# Altium schematic sheet FIT_FPGA_B_D_F.SchDoc
size A3; SheetNumber: 18; SheetTotal: 29
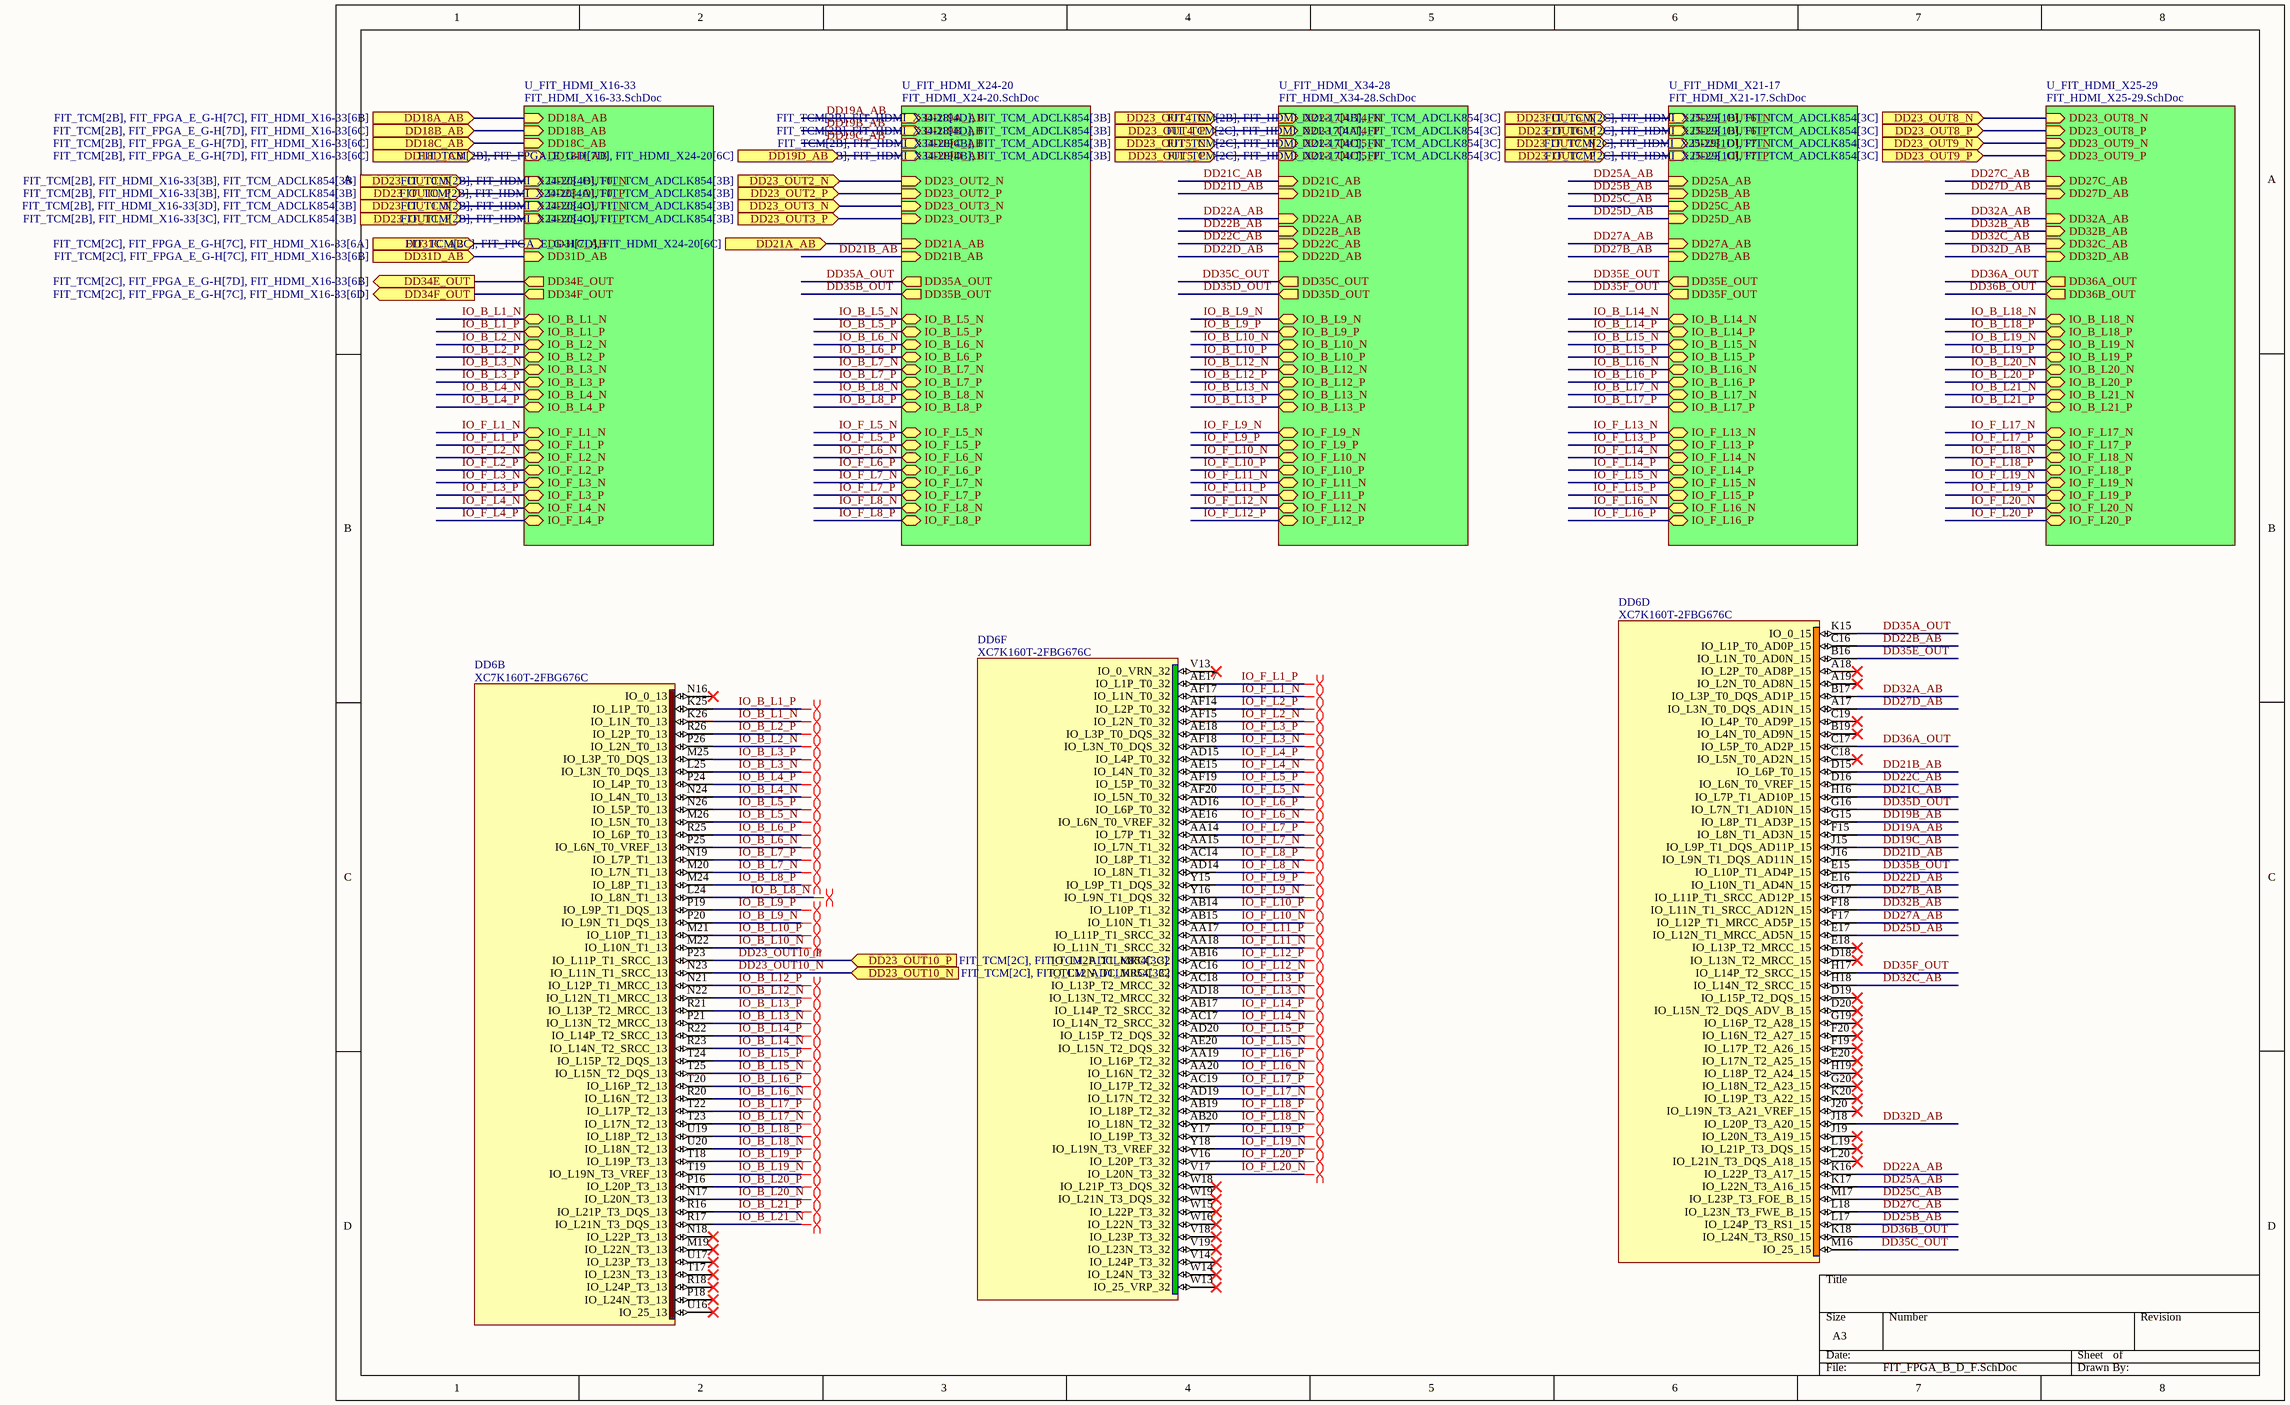
[diagram p0: FIT_FPGA_B_D_F.SchDoc]

## Parts
DD6  XC7K160T-2FBG676C  [BGA676C100P26X26_2700X2700X254]  (parts B,D,F of 15)

## Sub-sheets
U_FIT_HDMI_X16-33 = FIT_HDMI_X16-33.SchDoc: IO_F_L1_P (bidir), IO_F_L1_N (bidir), IO_F_L2_P (bidir), IO_F_L2_N (bidir), IO_B_L1_P (bidir), IO_B_L1_N (bidir), IO_B_L2_P (bidir), IO_B_L2_N (bidir), DD23_OUT0_P (in), DD23_OUT0_N (in), IO_F_L3_P (bidir), IO_F_L3_N (bidir), IO_F_L4_P (bidir), IO_F_L4_N (bidir), IO_B_L3_P (bidir), IO_B_L3_N (bidir), IO_B_L4_P (bidir), IO_B_L4_N (bidir), DD23_OUT1_P (in), DD23_OUT1_N (in), DD31C_AB (in), DD31D_AB (in), DD18A_AB (in), DD34E_OUT (out), DD18B_AB (in), DD18C_AB (in), DD18D_AB (in), DD34F_OUT (out)
U_FIT_HDMI_X21-17 = FIT_HDMI_X21-17.SchDoc: IO_F_L13_P (bidir), IO_F_L13_N (bidir), IO_F_L14_P (bidir), IO_F_L14_N (bidir), IO_B_L14_P (bidir), IO_B_L14_N (bidir), IO_B_L15_P (bidir), IO_B_L15_N (bidir), DD23_OUT6_P (in), DD23_OUT6_N (in), IO_F_L15_P (bidir), IO_F_L15_N (bidir), IO_F_L16_P (bidir), IO_F_L16_N (bidir), IO_B_L16_P (bidir), IO_B_L16_N (bidir), IO_B_L17_P (bidir), IO_B_L17_N (bidir), DD23_OUT7_P (in), DD23_OUT7_N (in), DD25A_AB (in), DD25B_AB (in), DD25C_AB (in), DD35E_OUT (out), DD25D_AB (in), DD27A_AB (in), DD27B_AB (in), DD35F_OUT (out)
U_FIT_HDMI_X24-20 = FIT_HDMI_X24-20.SchDoc: IO_F_L5_P (bidir), IO_F_L5_N (bidir), IO_F_L6_P (bidir), IO_F_L6_N (bidir), IO_B_L5_P (bidir), IO_B_L5_N (bidir), IO_B_L6_P (bidir), IO_B_L6_N (bidir), DD23_OUT2_P (in), DD23_OUT2_N (in), IO_F_L7_P (bidir), IO_F_L7_N (bidir), IO_F_L8_P (bidir), IO_F_L8_N (bidir), IO_B_L7_P (bidir), IO_B_L7_N (bidir), IO_B_L8_P (bidir), IO_B_L8_N (bidir), DD23_OUT3_P (in), DD23_OUT3_N (in), DD19A_AB (in), DD19B_AB (in), DD19C_AB (in), DD35A_OUT (out), DD19D_AB (in), DD21A_AB (in), DD21B_AB (in), DD35B_OUT (out)
U_FIT_HDMI_X25-29 = FIT_HDMI_X25-29.SchDoc: IO_B_L19_N (bidir), DD23_OUT8_P (in), DD23_OUT8_N (in), IO_B_L19_P (bidir), IO_B_L18_N (bidir), IO_B_L18_P (bidir), IO_F_L18_N (bidir), IO_F_L18_P (bidir), IO_F_L17_N (bidir), IO_F_L17_P (bidir), DD27C_AB (in), DD27D_AB (in), DD32A_AB (in), DD36A_OUT (out), IO_F_L19_P (bidir), IO_F_L19_N (bidir), IO_F_L20_P (bidir), IO_F_L20_N (bidir), IO_B_L20_P (bidir), IO_B_L20_N (bidir), IO_B_L21_P (bidir), IO_B_L21_N (bidir), DD23_OUT9_P (in), DD23_OUT9_N (in), DD32B_AB (in), DD32C_AB (in), DD32D_AB (in), DD36B_OUT (out)
U_FIT_HDMI_X34-28 = FIT_HDMI_X34-28.SchDoc: IO_F_L11_P (bidir), IO_F_L11_N (bidir), IO_F_L12_P (bidir), IO_F_L12_N (bidir), IO_B_L12_P (bidir), IO_B_L12_N (bidir), IO_B_L13_P (bidir), IO_B_L13_N (bidir), DD23_OUT5_P (in), DD23_OUT5_N (in), IO_F_L9_P (bidir), IO_F_L9_N (bidir), IO_F_L10_P (bidir), IO_F_L10_N (bidir), IO_B_L9_P (bidir), IO_B_L9_N (bidir), IO_B_L10_P (bidir), IO_B_L10_N (bidir), DD23_OUT4_P (in), DD23_OUT4_N (in), DD22B_AB (in), DD22C_AB (in), DD22D_AB (in), DD35D_OUT (out), DD21C_AB (in), DD21D_AB (in), DD22A_AB (in), DD35C_OUT (out)

## Ports
DD18A_AB (in, see FIT_TCM[2B], FIT_FPGA_E_G-H[7C], FIT_HDMI_X16-33[6B]), DD18B_AB (in, see FIT_TCM[2B], FIT_FPGA_E_G-H[7D], FIT_HDMI_X16-33[6C]), DD18C_AB (in, see FIT_TCM[2B], FIT_FPGA_E_G-H[7D], FIT_HDMI_X16-33[6C]), DD18D_AB (in, see FIT_TCM[2B], FIT_FPGA_E_G-H[7D], FIT_HDMI_X16-33[6C]), DD19D_AB (in, see FIT_TCM[2B], FIT_FPGA_E_G-H[7D], FIT_HDMI_X24-20[6C]), DD21A_AB (in, see FIT_TCM[2C], FIT_FPGA_E_G-H[7D], FIT_HDMI_X24-20[6C]), DD23_OUT0_N (in, see FIT_TCM[2B], FIT_HDMI_X16-33[3B], FIT_TCM_ADCLK854[3B]), DD23_OUT0_P (in, see FIT_TCM[2B], FIT_HDMI_X16-33[3B], FIT_TCM_ADCLK854[3B]), DD23_OUT1_N (in, see FIT_TCM[2B], FIT_HDMI_X16-33[3D], FIT_TCM_ADCLK854[3B]), DD23_OUT1_P (in, see FIT_TCM[2B], FIT_HDMI_X16-33[3C], FIT_TCM_ADCLK854[3B]), DD23_OUT2_N (in, see FIT_TCM[2B], FIT_HDMI_X24-20[4B], FIT_TCM_ADCLK854[3B]), DD23_OUT2_P (in, see FIT_TCM[2B], FIT_HDMI_X24-20[4A], FIT_TCM_ADCLK854[3B]), DD23_OUT3_N (in, see FIT_TCM[2B], FIT_HDMI_X24-20[4C], FIT_TCM_ADCLK854[3B]), DD23_OUT3_P (in, see FIT_TCM[2B], FIT_HDMI_X24-20[4C], FIT_TCM_ADCLK854[3B]), DD23_OUT4_N (in, see FIT_TCM[2B], FIT_HDMI_X34-28[4D], FIT_TCM_ADCLK854[3B]), DD23_OUT4_P (in, see FIT_TCM[2B], FIT_HDMI_X34-28[4D], FIT_TCM_ADCLK854[3B]), DD23_OUT5_N (in, see FIT_TCM[2B], FIT_HDMI_X34-28[4B], FIT_TCM_ADCLK854[3B]), DD23_OUT5_P (in, see FIT_TCM[2B], FIT_HDMI_X34-28[4B], FIT_TCM_ADCLK854[3B]), DD23_OUT6_N (in, see FIT_TCM[2B], FIT_HDMI_X21-17[4B], FIT_TCM_ADCLK854[3C]), DD23_OUT6_P (in, see FIT_TCM[2C], FIT_HDMI_X21-17[4A], FIT_TCM_ADCLK854[3C]), DD23_OUT7_N (in, see FIT_TCM[2C], FIT_HDMI_X21-17[4C], FIT_TCM_ADCLK854[3C]), DD23_OUT7_P (in, see FIT_TCM[2C], FIT_HDMI_X21-17[4C], FIT_TCM_ADCLK854[3C]), DD23_OUT8_N (in, see FIT_TCM[2C], FIT_HDMI_X25-29[1B], FIT_TCM_ADCLK854[3C]), DD23_OUT8_P (in, see FIT_TCM[2C], FIT_HDMI_X25-29[1B], FIT_TCM_ADCLK854[3C]), DD23_OUT9_N (in, see FIT_TCM[2C], FIT_HDMI_X25-29[1D], FIT_TCM_ADCLK854[3C]), DD23_OUT9_P (in, see FIT_TCM[2C], FIT_HDMI_X25-29[1C], FIT_TCM_ADCLK854[3C]), DD23_OUT10_N (in, see FIT_TCM[2C], FIT_TCM_ADCLK854[3C]), DD23_OUT10_P (in, see FIT_TCM[2C], FIT_TCM_ADCLK854[3C]), DD31C_AB (in, see FIT_TCM[2C], FIT_FPGA_E_G-H[7C], FIT_HDMI_X16-33[6A]), DD31D_AB (in, see FIT_TCM[2C], FIT_FPGA_E_G-H[7C], FIT_HDMI_X16-33[6B]), DD34E_OUT (out, see FIT_TCM[2C], FIT_FPGA_E_G-H[7D], FIT_HDMI_X16-33[6B]), DD34F_OUT (out, see FIT_TCM[2C], FIT_FPGA_E_G-H[7C], FIT_HDMI_X16-33[6D])

## Nets
DD18A_AB: port DD18A_AB, sheet U_FIT_HDMI_X16-33/DD18A_AB
DD18B_AB: port DD18B_AB, sheet U_FIT_HDMI_X16-33/DD18B_AB
DD18C_AB: port DD18C_AB, sheet U_FIT_HDMI_X16-33/DD18C_AB
DD18D_AB: port DD18D_AB, sheet U_FIT_HDMI_X16-33/DD18D_AB
DD19A_AB: DD6.F15(IO_L8N_T1_AD3N_15) ; sheet U_FIT_HDMI_X24-20/DD19A_AB
DD19B_AB: DD6.G15(IO_L8P_T1_AD3P_15) ; sheet U_FIT_HDMI_X24-20/DD19B_AB
DD19C_AB: DD6.J15(IO_L9P_T1_DQS_AD11P_15) ; sheet U_FIT_HDMI_X24-20/DD19C_AB
DD19D_AB: port DD19D_AB, sheet U_FIT_HDMI_X24-20/DD19D_AB
DD21A_AB: port DD21A_AB, sheet U_FIT_HDMI_X24-20/DD21A_AB
DD21B_AB: DD6.D15(IO_L6P_T0_15) ; sheet U_FIT_HDMI_X24-20/DD21B_AB
DD21C_AB: DD6.H16(IO_L7P_T1_AD10P_15) ; sheet U_FIT_HDMI_X34-28/DD21C_AB
DD21D_AB: DD6.J16(IO_L9N_T1_DQS_AD11N_15) ; sheet U_FIT_HDMI_X34-28/DD21D_AB
DD22A_AB: DD6.K16(IO_L22P_T3_A17_15) ; sheet U_FIT_HDMI_X34-28/DD22A_AB
DD22B_AB: DD6.C16(IO_L1P_T0_AD0P_15) ; sheet U_FIT_HDMI_X34-28/DD22B_AB
DD22C_AB: DD6.D16(IO_L6N_T0_VREF_15) ; sheet U_FIT_HDMI_X34-28/DD22C_AB
DD22D_AB: DD6.E16(IO_L10N_T1_AD4N_15) ; sheet U_FIT_HDMI_X34-28/DD22D_AB
DD23_OUT0_N: port DD23_OUT0_N, sheet U_FIT_HDMI_X16-33/DD23_OUT0_N
DD23_OUT0_P: port DD23_OUT0_P, sheet U_FIT_HDMI_X16-33/DD23_OUT0_P
DD23_OUT1_N: port DD23_OUT1_N, sheet U_FIT_HDMI_X16-33/DD23_OUT1_N
DD23_OUT1_P: port DD23_OUT1_P, sheet U_FIT_HDMI_X16-33/DD23_OUT1_P
DD23_OUT2_N: port DD23_OUT2_N, sheet U_FIT_HDMI_X24-20/DD23_OUT2_N
DD23_OUT2_P: port DD23_OUT2_P, sheet U_FIT_HDMI_X24-20/DD23_OUT2_P
DD23_OUT3_N: port DD23_OUT3_N, sheet U_FIT_HDMI_X24-20/DD23_OUT3_N
DD23_OUT3_P: port DD23_OUT3_P, sheet U_FIT_HDMI_X24-20/DD23_OUT3_P
DD23_OUT4_N: port DD23_OUT4_N, sheet U_FIT_HDMI_X34-28/DD23_OUT4_N
DD23_OUT4_P: port DD23_OUT4_P, sheet U_FIT_HDMI_X34-28/DD23_OUT4_P
DD23_OUT5_N: port DD23_OUT5_N, sheet U_FIT_HDMI_X34-28/DD23_OUT5_N
DD23_OUT5_P: port DD23_OUT5_P, sheet U_FIT_HDMI_X34-28/DD23_OUT5_P
DD23_OUT6_N: port DD23_OUT6_N, sheet U_FIT_HDMI_X21-17/DD23_OUT6_N
DD23_OUT6_P: port DD23_OUT6_P, sheet U_FIT_HDMI_X21-17/DD23_OUT6_P
DD23_OUT7_N: port DD23_OUT7_N, sheet U_FIT_HDMI_X21-17/DD23_OUT7_N
DD23_OUT7_P: port DD23_OUT7_P, sheet U_FIT_HDMI_X21-17/DD23_OUT7_P
DD23_OUT8_N: port DD23_OUT8_N, sheet U_FIT_HDMI_X25-29/DD23_OUT8_N
DD23_OUT8_P: port DD23_OUT8_P, sheet U_FIT_HDMI_X25-29/DD23_OUT8_P
DD23_OUT9_N: port DD23_OUT9_N, sheet U_FIT_HDMI_X25-29/DD23_OUT9_N
DD23_OUT9_P: port DD23_OUT9_P, sheet U_FIT_HDMI_X25-29/DD23_OUT9_P
DD23_OUT10_N: DD6.N23(IO_L11N_T1_SRCC_13) ; port DD23_OUT10_N
DD23_OUT10_P: DD6.P23(IO_L11P_T1_SRCC_13) ; port DD23_OUT10_P
DD25A_AB: DD6.K17(IO_L22N_T3_A16_15) ; sheet U_FIT_HDMI_X21-17/DD25A_AB
DD25B_AB: DD6.L17(IO_L24P_T3_RS1_15) ; sheet U_FIT_HDMI_X21-17/DD25B_AB
DD25C_AB: DD6.M17(IO_L23P_T3_FOE_B_15) ; sheet U_FIT_HDMI_X21-17/DD25C_AB
DD25D_AB: DD6.E17(IO_L12N_T1_MRCC_AD5N_15) ; sheet U_FIT_HDMI_X21-17/DD25D_AB
DD27A_AB: DD6.F17(IO_L12P_T1_MRCC_AD5P_15) ; sheet U_FIT_HDMI_X21-17/DD27A_AB
DD27B_AB: DD6.G17(IO_L11P_T1_SRCC_AD12P_15) ; sheet U_FIT_HDMI_X21-17/DD27B_AB
DD27C_AB: DD6.L18(IO_L23N_T3_FWE_B_15) ; sheet U_FIT_HDMI_X25-29/DD27C_AB
DD27D_AB: DD6.A17(IO_L3N_T0_DQS_AD1N_15) ; sheet U_FIT_HDMI_X25-29/DD27D_AB
DD31C_AB: port DD31C_AB, sheet U_FIT_HDMI_X16-33/DD31C_AB
DD31D_AB: port DD31D_AB, sheet U_FIT_HDMI_X16-33/DD31D_AB
DD32A_AB: DD6.B17(IO_L3P_T0_DQS_AD1P_15) ; sheet U_FIT_HDMI_X25-29/DD32A_AB
DD32B_AB: DD6.F18(IO_L11N_T1_SRCC_AD12N_15) ; sheet U_FIT_HDMI_X25-29/DD32B_AB
DD32C_AB: DD6.H18(IO_L14N_T2_SRCC_15) ; sheet U_FIT_HDMI_X25-29/DD32C_AB
DD32D_AB: DD6.J18(IO_L20P_T3_A20_15) ; sheet U_FIT_HDMI_X25-29/DD32D_AB
DD34E_OUT: port DD34E_OUT, sheet U_FIT_HDMI_X16-33/DD34E_OUT
DD34F_OUT: port DD34F_OUT, sheet U_FIT_HDMI_X16-33/DD34F_OUT
DD35A_OUT: DD6.K15(IO_0_15) ; sheet U_FIT_HDMI_X24-20/DD35A_OUT
DD35B_OUT: DD6.E15(IO_L10P_T1_AD4P_15) ; sheet U_FIT_HDMI_X24-20/DD35B_OUT
DD35C_OUT: DD6.M16(IO_25_15) ; sheet U_FIT_HDMI_X34-28/DD35C_OUT
DD35D_OUT: DD6.G16(IO_L7N_T1_AD10N_15) ; sheet U_FIT_HDMI_X34-28/DD35D_OUT
DD35E_OUT: DD6.B16(IO_L1N_T0_AD0N_15) ; sheet U_FIT_HDMI_X21-17/DD35E_OUT
DD35F_OUT: DD6.H17(IO_L14P_T2_SRCC_15) ; sheet U_FIT_HDMI_X21-17/DD35F_OUT
DD36A_OUT: DD6.C17(IO_L5P_T0_AD2P_15) ; sheet U_FIT_HDMI_X25-29/DD36A_OUT
DD36B_OUT: DD6.K18(IO_L24N_T3_RS0_15) ; sheet U_FIT_HDMI_X25-29/DD36B_OUT
IO_B_L1_N: DD6.K26(IO_L1N_T0_13) ; sheet U_FIT_HDMI_X16-33/IO_B_L1_N
IO_B_L1_P: DD6.K25(IO_L1P_T0_13) ; sheet U_FIT_HDMI_X16-33/IO_B_L1_P
IO_B_L2_N: DD6.P26(IO_L2N_T0_13) ; sheet U_FIT_HDMI_X16-33/IO_B_L2_N
IO_B_L2_P: DD6.R26(IO_L2P_T0_13) ; sheet U_FIT_HDMI_X16-33/IO_B_L2_P
IO_B_L3_N: DD6.L25(IO_L3N_T0_DQS_13) ; sheet U_FIT_HDMI_X16-33/IO_B_L3_N
IO_B_L3_P: DD6.M25(IO_L3P_T0_DQS_13) ; sheet U_FIT_HDMI_X16-33/IO_B_L3_P
IO_B_L4_N: DD6.N24(IO_L4N_T0_13) ; sheet U_FIT_HDMI_X16-33/IO_B_L4_N
IO_B_L4_P: DD6.P24(IO_L4P_T0_13) ; sheet U_FIT_HDMI_X16-33/IO_B_L4_P
IO_B_L5_N: DD6.M26(IO_L5N_T0_13) ; sheet U_FIT_HDMI_X24-20/IO_B_L5_N
IO_B_L5_P: DD6.N26(IO_L5P_T0_13) ; sheet U_FIT_HDMI_X24-20/IO_B_L5_P
IO_B_L6_N: DD6.P25(IO_L6N_T0_VREF_13) ; sheet U_FIT_HDMI_X24-20/IO_B_L6_N
IO_B_L6_P: DD6.R25(IO_L6P_T0_13) ; sheet U_FIT_HDMI_X24-20/IO_B_L6_P
IO_B_L7_N: DD6.M20(IO_L7N_T1_13) ; sheet U_FIT_HDMI_X24-20/IO_B_L7_N
IO_B_L7_P: DD6.N19(IO_L7P_T1_13) ; sheet U_FIT_HDMI_X24-20/IO_B_L7_P
IO_B_L8_N: DD6.L24(IO_L8N_T1_13) ; sheet U_FIT_HDMI_X24-20/IO_B_L8_N
IO_B_L8_P: DD6.M24(IO_L8P_T1_13) ; sheet U_FIT_HDMI_X24-20/IO_B_L8_P
IO_B_L9_N: DD6.P20(IO_L9N_T1_DQS_13) ; sheet U_FIT_HDMI_X34-28/IO_B_L9_N
IO_B_L9_P: DD6.P19(IO_L9P_T1_DQS_13) ; sheet U_FIT_HDMI_X34-28/IO_B_L9_P
IO_B_L10_N: DD6.M22(IO_L10N_T1_13) ; sheet U_FIT_HDMI_X34-28/IO_B_L10_N
IO_B_L10_P: DD6.M21(IO_L10P_T1_13) ; sheet U_FIT_HDMI_X34-28/IO_B_L10_P
IO_B_L12_N: DD6.N22(IO_L12N_T1_MRCC_13) ; sheet U_FIT_HDMI_X34-28/IO_B_L12_N
IO_B_L12_P: DD6.N21(IO_L12P_T1_MRCC_13) ; sheet U_FIT_HDMI_X34-28/IO_B_L12_P
IO_B_L13_N: DD6.P21(IO_L13N_T2_MRCC_13) ; sheet U_FIT_HDMI_X34-28/IO_B_L13_N
IO_B_L13_P: DD6.R21(IO_L13P_T2_MRCC_13) ; sheet U_FIT_HDMI_X34-28/IO_B_L13_P
IO_B_L14_N: DD6.R23(IO_L14N_T2_SRCC_13) ; sheet U_FIT_HDMI_X21-17/IO_B_L14_N
IO_B_L14_P: DD6.R22(IO_L14P_T2_SRCC_13) ; sheet U_FIT_HDMI_X21-17/IO_B_L14_P
IO_B_L15_N: DD6.T25(IO_L15N_T2_DQS_13) ; sheet U_FIT_HDMI_X21-17/IO_B_L15_N
IO_B_L15_P: DD6.T24(IO_L15P_T2_DQS_13) ; sheet U_FIT_HDMI_X21-17/IO_B_L15_P
IO_B_L16_N: DD6.R20(IO_L16N_T2_13) ; sheet U_FIT_HDMI_X21-17/IO_B_L16_N
IO_B_L16_P: DD6.T20(IO_L16P_T2_13) ; sheet U_FIT_HDMI_X21-17/IO_B_L16_P
IO_B_L17_N: DD6.T23(IO_L17N_T2_13) ; sheet U_FIT_HDMI_X21-17/IO_B_L17_N
IO_B_L17_P: DD6.T22(IO_L17P_T2_13) ; sheet U_FIT_HDMI_X21-17/IO_B_L17_P
IO_B_L18_N: DD6.U20(IO_L18N_T2_13) ; sheet U_FIT_HDMI_X25-29/IO_B_L18_N
IO_B_L18_P: DD6.U19(IO_L18P_T2_13) ; sheet U_FIT_HDMI_X25-29/IO_B_L18_P
IO_B_L19_N: DD6.T19(IO_L19N_T3_VREF_13) ; sheet U_FIT_HDMI_X25-29/IO_B_L19_N
IO_B_L19_P: DD6.T18(IO_L19P_T3_13) ; sheet U_FIT_HDMI_X25-29/IO_B_L19_P
IO_B_L20_N: DD6.N17(IO_L20N_T3_13) ; sheet U_FIT_HDMI_X25-29/IO_B_L20_N
IO_B_L20_P: DD6.P16(IO_L20P_T3_13) ; sheet U_FIT_HDMI_X25-29/IO_B_L20_P
IO_B_L21_N: DD6.R17(IO_L21N_T3_DQS_13) ; sheet U_FIT_HDMI_X25-29/IO_B_L21_N
IO_B_L21_P: DD6.R16(IO_L21P_T3_DQS_13) ; sheet U_FIT_HDMI_X25-29/IO_B_L21_P
IO_F_L1_N: DD6.AF17(IO_L1N_T0_32) ; sheet U_FIT_HDMI_X16-33/IO_F_L1_N
IO_F_L1_P: DD6.AE17(IO_L1P_T0_32) ; sheet U_FIT_HDMI_X16-33/IO_F_L1_P
IO_F_L2_N: DD6.AF15(IO_L2N_T0_32) ; sheet U_FIT_HDMI_X16-33/IO_F_L2_N
IO_F_L2_P: DD6.AF14(IO_L2P_T0_32) ; sheet U_FIT_HDMI_X16-33/IO_F_L2_P
IO_F_L3_N: DD6.AF18(IO_L3N_T0_DQS_32) ; sheet U_FIT_HDMI_X16-33/IO_F_L3_N
IO_F_L3_P: DD6.AE18(IO_L3P_T0_DQS_32) ; sheet U_FIT_HDMI_X16-33/IO_F_L3_P
IO_F_L4_N: DD6.AE15(IO_L4N_T0_32) ; sheet U_FIT_HDMI_X16-33/IO_F_L4_N
IO_F_L4_P: DD6.AD15(IO_L4P_T0_32) ; sheet U_FIT_HDMI_X16-33/IO_F_L4_P
IO_F_L5_N: DD6.AF20(IO_L5N_T0_32) ; sheet U_FIT_HDMI_X24-20/IO_F_L5_N
IO_F_L5_P: DD6.AF19(IO_L5P_T0_32) ; sheet U_FIT_HDMI_X24-20/IO_F_L5_P
IO_F_L6_N: DD6.AE16(IO_L6N_T0_VREF_32) ; sheet U_FIT_HDMI_X24-20/IO_F_L6_N
IO_F_L6_P: DD6.AD16(IO_L6P_T0_32) ; sheet U_FIT_HDMI_X24-20/IO_F_L6_P
IO_F_L7_N: DD6.AA15(IO_L7N_T1_32) ; sheet U_FIT_HDMI_X24-20/IO_F_L7_N
IO_F_L7_P: DD6.AA14(IO_L7P_T1_32) ; sheet U_FIT_HDMI_X24-20/IO_F_L7_P
IO_F_L8_N: DD6.AD14(IO_L8N_T1_32) ; sheet U_FIT_HDMI_X24-20/IO_F_L8_N
IO_F_L8_P: DD6.AC14(IO_L8P_T1_32) ; sheet U_FIT_HDMI_X24-20/IO_F_L8_P
IO_F_L9_N: DD6.Y16(IO_L9N_T1_DQS_32) ; sheet U_FIT_HDMI_X34-28/IO_F_L9_N
IO_F_L9_P: DD6.Y15(IO_L9P_T1_DQS_32) ; sheet U_FIT_HDMI_X34-28/IO_F_L9_P
IO_F_L10_N: DD6.AB15(IO_L10N_T1_32) ; sheet U_FIT_HDMI_X34-28/IO_F_L10_N
IO_F_L10_P: DD6.AB14(IO_L10P_T1_32) ; sheet U_FIT_HDMI_X34-28/IO_F_L10_P
IO_F_L11_N: DD6.AA18(IO_L11N_T1_SRCC_32) ; sheet U_FIT_HDMI_X34-28/IO_F_L11_N
IO_F_L11_P: DD6.AA17(IO_L11P_T1_SRCC_32) ; sheet U_FIT_HDMI_X34-28/IO_F_L11_P
IO_F_L12_N: DD6.AC16(IO_L12N_T1_MRCC_32) ; sheet U_FIT_HDMI_X34-28/IO_F_L12_N
IO_F_L12_P: DD6.AB16(IO_L12P_T1_MRCC_32) ; sheet U_FIT_HDMI_X34-28/IO_F_L12_P
IO_F_L13_N: DD6.AD18(IO_L13N_T2_MRCC_32) ; sheet U_FIT_HDMI_X21-17/IO_F_L13_N
IO_F_L13_P: DD6.AC18(IO_L13P_T2_MRCC_32) ; sheet U_FIT_HDMI_X21-17/IO_F_L13_P
IO_F_L14_N: DD6.AC17(IO_L14N_T2_SRCC_32) ; sheet U_FIT_HDMI_X21-17/IO_F_L14_N
IO_F_L14_P: DD6.AB17(IO_L14P_T2_SRCC_32) ; sheet U_FIT_HDMI_X21-17/IO_F_L14_P
IO_F_L15_N: DD6.AE20(IO_L15N_T2_DQS_32) ; sheet U_FIT_HDMI_X21-17/IO_F_L15_N
IO_F_L15_P: DD6.AD20(IO_L15P_T2_DQS_32) ; sheet U_FIT_HDMI_X21-17/IO_F_L15_P
IO_F_L16_N: DD6.AA20(IO_L16N_T2_32) ; sheet U_FIT_HDMI_X21-17/IO_F_L16_N
IO_F_L16_P: DD6.AA19(IO_L16P_T2_32) ; sheet U_FIT_HDMI_X21-17/IO_F_L16_P
IO_F_L17_N: DD6.AD19(IO_L17N_T2_32) ; sheet U_FIT_HDMI_X25-29/IO_F_L17_N
IO_F_L17_P: DD6.AC19(IO_L17P_T2_32) ; sheet U_FIT_HDMI_X25-29/IO_F_L17_P
IO_F_L18_N: DD6.AB20(IO_L18N_T2_32) ; sheet U_FIT_HDMI_X25-29/IO_F_L18_N
IO_F_L18_P: DD6.AB19(IO_L18P_T2_32) ; sheet U_FIT_HDMI_X25-29/IO_F_L18_P
IO_F_L19_N: DD6.Y18(IO_L19N_T3_VREF_32) ; sheet U_FIT_HDMI_X25-29/IO_F_L19_N
IO_F_L19_P: DD6.Y17(IO_L19P_T3_32) ; sheet U_FIT_HDMI_X25-29/IO_F_L19_P
IO_F_L20_N: DD6.V17(IO_L20N_T3_32) ; sheet U_FIT_HDMI_X25-29/IO_F_L20_N
IO_F_L20_P: DD6.V16(IO_L20P_T3_32) ; sheet U_FIT_HDMI_X25-29/IO_F_L20_P

Not connected (* = marked no-connect by the designer): DD6 A18(IO_L2P_T0_AD8P_15)* A19(IO_L2N_T0_AD8N_15)* B19(IO_L4N_T0_AD9N_15)* C18(IO_L5N_T0_AD2N_15)* C19(IO_L4P_T0_AD9P_15)* D18(IO_L13N_T2_MRCC_15)* D19(IO_L15P_T2_DQS_15)* D20(IO_L15N_T2_DQS_ADV_B_15)* E18(IO_L13P_T2_MRCC_15)* E20(IO_L17N_T2_A25_15)* F19(IO_L17P_T2_A26_15)* F20(IO_L16N_T2_A27_15)* G19(IO_L16P_T2_A28_15)* G20(IO_L18N_T2_A23_15)* H19(IO_L18P_T2_A24_15)* J19(IO_L20N_T3_A19_15)* J20(IO_L19N_T3_A21_VREF_15)* K20(IO_L19P_T3_A22_15)* L19(IO_L21P_T3_DQS_15)* L20(IO_L21N_T3_DQS_A18_15)* M19(IO_L22N_T3_13)* N16(IO_0_13)* N18(IO_L22P_T3_13)* P18(IO_L24N_T3_13)* R18(IO_L24P_T3_13)* T17(IO_L23N_T3_13)* U16(IO_25_13)* U17(IO_L23P_T3_13)* V13(IO_0_VRN_32)* V14(IO_L24P_T3_32)* V18(IO_L23P_T3_32)* V19(IO_L23N_T3_32)* W13(IO_25_VRP_32)* W14(IO_L24N_T3_32)* W15(IO_L22P_T3_32)* W16(IO_L22N_T3_32)* W18(IO_L21P_T3_DQS_32)* W19(IO_L21N_T3_DQS_32)*

## Layout directives
differential pair: IO_B_L1_N, IO_B_L1_P, IO_B_L2_N, IO_B_L2_P, IO_B_L3_N, IO_B_L3_P, IO_B_L4_N, IO_B_L4_P, IO_B_L5_N, IO_B_L5_P, IO_B_L6_N, IO_B_L6_P, IO_B_L7_N, IO_B_L7_P, IO_B_L8_N, IO_B_L8_P, IO_B_L9_N, IO_B_L9_P, IO_B_L10_N, IO_B_L10_P, IO_B_L12_N, IO_B_L12_P, IO_B_L13_N, IO_B_L13_P, IO_B_L14_N, IO_B_L14_P, IO_B_L15_N, IO_B_L15_P, IO_B_L16_N, IO_B_L16_P, IO_B_L17_N, IO_B_L17_P, IO_B_L18_N, IO_B_L18_P, IO_B_L19_N, IO_B_L19_P, IO_B_L20_N, IO_B_L20_P, IO_B_L21_N, IO_B_L21_P, IO_F_L1_N, IO_F_L1_P, IO_F_L2_N, IO_F_L2_P, IO_F_L3_N, IO_F_L3_P, IO_F_L4_N, IO_F_L4_P, IO_F_L5_N, IO_F_L5_P, IO_F_L6_N, IO_F_L6_P, IO_F_L7_N, IO_F_L7_P, IO_F_L8_N, IO_F_L8_P, IO_F_L9_N, IO_F_L9_P, IO_F_L10_N, IO_F_L10_P, IO_F_L11_N, IO_F_L11_P, IO_F_L12_N, IO_F_L12_P, IO_F_L13_N, IO_F_L13_P, IO_F_L14_N, IO_F_L14_P, IO_F_L15_N, IO_F_L15_P, IO_F_L16_N, IO_F_L16_P, IO_F_L17_N, IO_F_L17_P, IO_F_L18_N, IO_F_L18_P, IO_F_L19_N, IO_F_L19_P, IO_F_L20_N, IO_F_L20_P

## Library data of the parts
DD6 = XC7K160T-2FBG676C: KINTEX-7, FPGA, 676-Ball BGA, Pb-Free; Part Description: KINTEX-7 FPGA, 162240 Logic Cells, 400 User I/O, 8 GTXs, 676-Ball BGA, Speed Grade 2, Commercial Grade, Pb-Free; Manufacturer: XILINX; PressFit: No; Bonding: No; Part Number: XC7K160T-2FBG676C; Component Kind: Standard; Component Type: Standard; Device: XC7K160T-2FBG676C; PackageDescription: BGA, 1.00mm Pitch, Square; 676 Pin, 26 Columns X 26 Rows, Body 27.0mm X 27.0mm X 2.54mm H, IPC Medium Density; Manufacturer Part Number: XC7K160T-2FBG676C; Pin Count: 676; Case: BGA676; Mounted: Yes; Socket: No; SMD: Yes; Sense: No; ComponentHeight: 2.54mm; HelpURL: \\cern.ch\dfs\Applications\Altium\Datasheets\XC7K160T-xFBG676C.pdf; ComponentLink1URL: \\cern.ch\dfs\Applications\Altium\Datasheets\XC7K160T-xFBG676C_Package-Pinout.pdf; ComponentLink1Description: Package/Pinout; Author: CERN DEM BC; CreateDate: 06.02.2020; LatestRevisionDate: 06.02.2020